# Altium schematic sheet DreamLight v1.SchDoc: DOCUMENT TITLE
size A4; Organization: Tor Brodtkorb; Address1: Frode Rinnans veg 193; Address2: 7050 Trondheim; DocumentNumber: 6598; Revision: 1.0; SheetNumber: 1; SheetTotal: 1
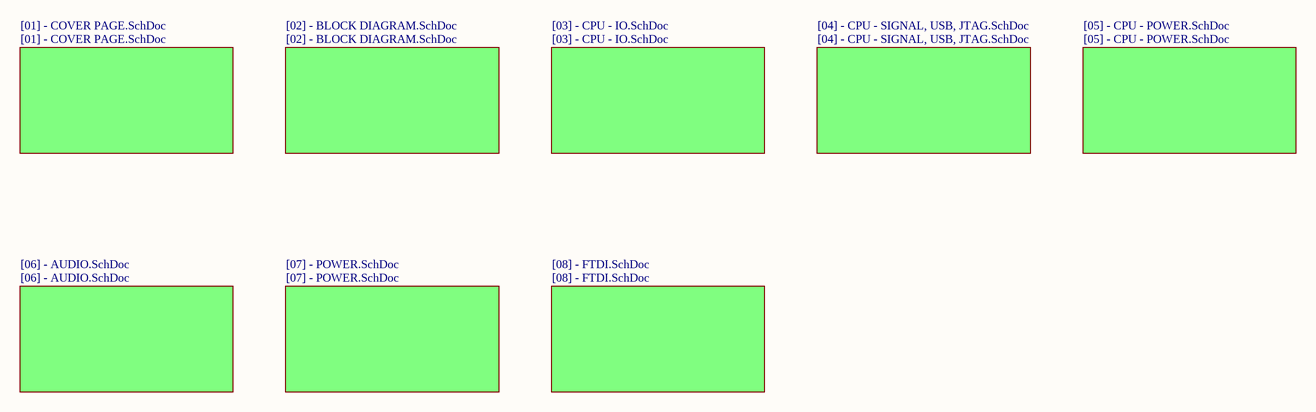
[diagram p0: DreamLight v1.SchDoc]

## Sub-sheets
[01] - COVER PAGE.SchDoc = [01] - COVER PAGE.SchDoc: no entries
[02] - BLOCK DIAGRAM.SchDoc = [02] - BLOCK DIAGRAM.SchDoc: no entries
[03] - CPU - IO.SchDoc = [03] - CPU - IO.SchDoc: no entries
[04] - CPU - SIGNAL, USB, JTAG.SchDoc = [04] - CPU - SIGNAL, USB, JTAG.SchDoc: no entries
[05] - CPU - POWER.SchDoc = [05] - CPU - POWER.SchDoc: no entries
[06] - AUDIO.SchDoc = [06] - AUDIO.SchDoc: no entries
[07] - POWER.SchDoc = [07] - POWER.SchDoc: no entries
[08] - FTDI.SchDoc = [08] - FTDI.SchDoc: no entries

## Notes on the sheet
- Title
- Size:
- Date:
- A4
- Number:
- Time:
- Revision:
- Sheet
- of
- File: